# EAGLE design TinyAPRS-mini (EAGLE 7.2.0)
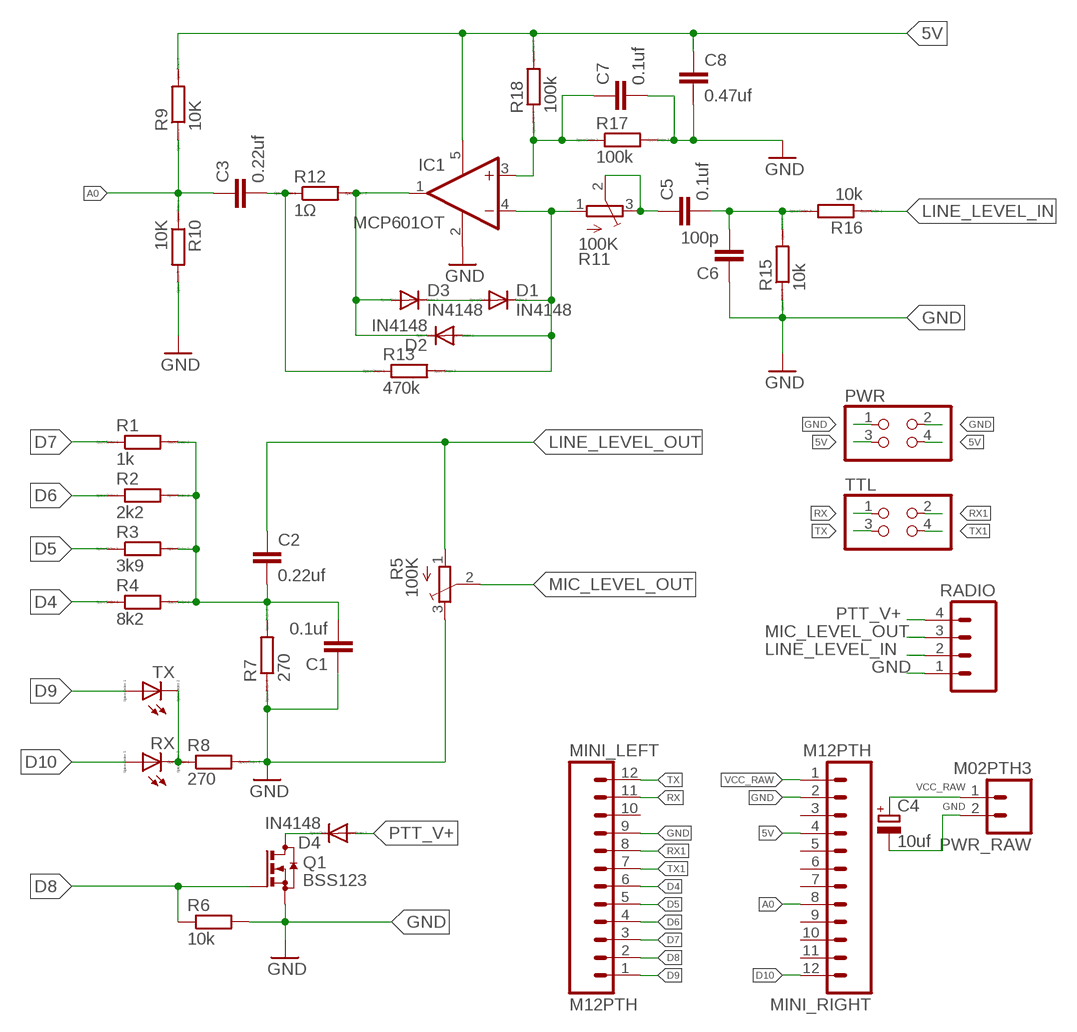
[diagram p0: schematic, sheet 1]

## Parts
C1  0.1uf  C-EU050-024X044  [C050-024X044]
C2  0.22uf  C-EU050-024X044  [C050-024X044]
C3  0.22uf  C-EU050-024X044  [C050-024X044]
C4  10uf  CPOL-EUE2.5-5  [E2,5-5]
C5  0.1uf  C-EU050-024X044  [C050-024X044]
C6  100p  C-EU050-024X044  [C050-024X044]
C7  0.1uf  C-EU050-024X044  [C050-024X044]
C8  0.47uf  C-EU050-024X044  [C050-024X044]
D1  IN4148  DIODE-D-2.5  [D-2.5]
D2  IN4148  DIODE-D-2.5  [D-2.5]
D3  IN4148  DIODE-D-2.5  [D-2.5]
D4  IN4148  DIODE-D-2.5  [D-2.5]
IC1  MCP601OT  [SOT23-5]
MINI_LEFT  M12PTH  [1X12]
MINI_RIGHT  M12PTH  [1X12]
PWR  PINHD-2X2  [2X02]
PWR_RAW  M02PTH3  [1X02_LONGPADS]
Q1  BSS123  [SOT23]
R1  1k  R-EU_0204_5  [0204/5]
R2  2k2  R-EU_0204_5  [0204/5]
R3  3k9  R-EU_0204_5  [0204/5]
R4  8k2  R-EU_0204_5  [0204/5]
R5  100K  TRIMPOTTC33X  [TC33X]
R6  10k  R-EU_0204/5  [0204/5]
R7  270  R-EU_0204_5  [0204/5]
R8  270  R-EU_0204_2V  [0204V]
R9  10K  R-EU_0204_5  [0204/5]
R10  10K  R-EU_0204_5  [0204/5]
R11  100K  TRIMPOTTC33X  [TC33X]
R12  1Ω  R-EU_0204_2V  [0204V]
R13  470k  R-EU_0204_5  [0204/5]
R15  10k  R-EU_0204_5  [0204/5]
R16  10k  R-EU_0204_5  [0204/5]
R17  100k  R-EU_0204_5  [0204/5]
R18  100k  R-EU_0204_5  [0204/5]
RADIO  M04PTH  [1X04]
RX  LED_ELD260  [LED_LD260]
TTL  PINHD-2X2  [2X02]
TX  LED_ELD260  [LED_LD260]

## Nets
5V: C8.1 IC1.5(V+) MINI_RIGHT.4 PWR.3 PWR.4 R9.2 R18.2
A0: C3.1 MINI_RIGHT.8 R9.1 R10.1
D4: MINI_LEFT.6 R4.1
D5: MINI_LEFT.5 R3.1
D6: MINI_LEFT.4 R2.1
D7: MINI_LEFT.3 R1.1
D8: MINI_LEFT.2 Q1.1(G) R6.1
D9: MINI_LEFT.1 TX.A
D10: MINI_RIGHT.12 RX.A
GND: C1.1 C4.- C6.1 C7.2 C8.2 IC1.2(V-) MINI_LEFT.9 MINI_RIGHT.2 PWR.1 PWR.2 PWR_RAW.2 Q1.2(S) R5.3(E) R6.2 R7.1 R8.2 R10.2 R15.1 R17.2 RADIO.1
LINE_LEVEL_IN: R16.1 RADIO.2
LINE_LEVEL_OUT: C2.1 R5.1(A)
MIC_LEVEL_OUT: R5.2(S) RADIO.3
N$1: R8.1 RX.K(C) TX.K(C)
N$2: D2.C D3.A IC1.1(OUT) R12.2
N$3: D1.C D2.A IC1.4(-IN) R11.1(A) R13.2
N$4: D4.C Q1.3(D)
N$6: C5.1 R11.2(S) R11.3(E)
N$7: C5.2 C6.2 R15.2 R16.2
N$8: C7.1 IC1.3(+IN) R17.1 R18.1
N$10: D1.A D3.C
N$11: C3.2 R12.1 R13.1
PTT_V+: D4.A RADIO.4
R_DAC: C1.2 C2.2 R1.2 R2.2 R3.2 R4.2 R7.2
RX: MINI_LEFT.11 TTL.1
RX1: MINI_LEFT.8 TTL.2
TX: MINI_LEFT.12 TTL.3
TX1: MINI_LEFT.7 TTL.4
VCC_RAW: C4.+ MINI_RIGHT.1 PWR_RAW.1
Unconnected: MINI_LEFT.10 MINI_RIGHT.3 MINI_RIGHT.5 MINI_RIGHT.6 MINI_RIGHT.7 MINI_RIGHT.9 MINI_RIGHT.10 MINI_RIGHT.11

## Library data of the parts
C1-C3 C5-C8 = rcl:C-EU: CAPACITOR, European symbol
C4 = rcl:CPOL-EU: POLARIZED CAPACITOR, European symbol
D1-D4 = diode:DIODE-: DIODE
IC1 = linear:MCP601: Single Op Amp 2.7V to 6.0V Single Supply CMOS Source: http://ww1.microchip.com/downloads/en/DeviceDoc/21314g.pdf
MINI_LEFT MINI_RIGHT = SparkFun-Connectors:M12: Header 12 Standard 12-pin 0.1" header. Use with straight break away headers (SKU : PRT-00116), right angle break away headers (PRT-00553), swiss pins (PRT-00743), machine pins (PRT-00117), and female headers (PRT-00115).
PWR TTL = pinhead:PINHD-2X2: PIN HEADER
PWR_RAW = SparkFun-Connectors:M02: Standard 2-pin 0.1" header. Use with - straight break away headers ( PRT-00116) - right angle break away headers (PRT-00553) - swiss pins (PRT-00743) - machine pins (PRT-00117) - female headers (PRT-00115) Molex polarized connector foot print use with: PRT-08233 with associated crimp pins and housings. 2.54_SCREWTERM for use with PRT-10571. 3.5mm Screw Terminal footprints for PRT-08084 5mm Screw Terminal footprints for use with PRT-08432
Q1 = transistor-small-signal:BSS123: N-CHANNEL MOS FET
R1-R4 R7-R10 R12 R13 R15-R18 = resistor:R-EU_: RESISTOR, European symbol; SPICEPREFIX: R
R5 R11 = adafruit:TRIMPOT: SMT trimmer potentiometer part number TC33X http://www.ladyada.net/library/eagle
R6 = rcl:R-EU_: RESISTOR, European symbol
RADIO = SparkFun-Connectors:M04: Header 4 Standard 4-pin 0.1" header. Use with straight break away headers (SKU : PRT-00116), right angle break away headers (PRT-00553), swiss pins (PRT-00743), machine pins (PRT-00117), and female headers (PRT-00115). Molex polarized connector foot print use with SKU : PRT-08231 with associated crimp pins and housings. 1MM SMD Version SKU: PRT-10208
RX TX = eagle-ltspice:LED_E: LED Source: http://www.osram.convergy.de Source: www.luxeon.com Source: www.kingbright.com; SPICEMODEL: NONE; SPICEPREFIX: D; SPICETYPE: diode

## Board
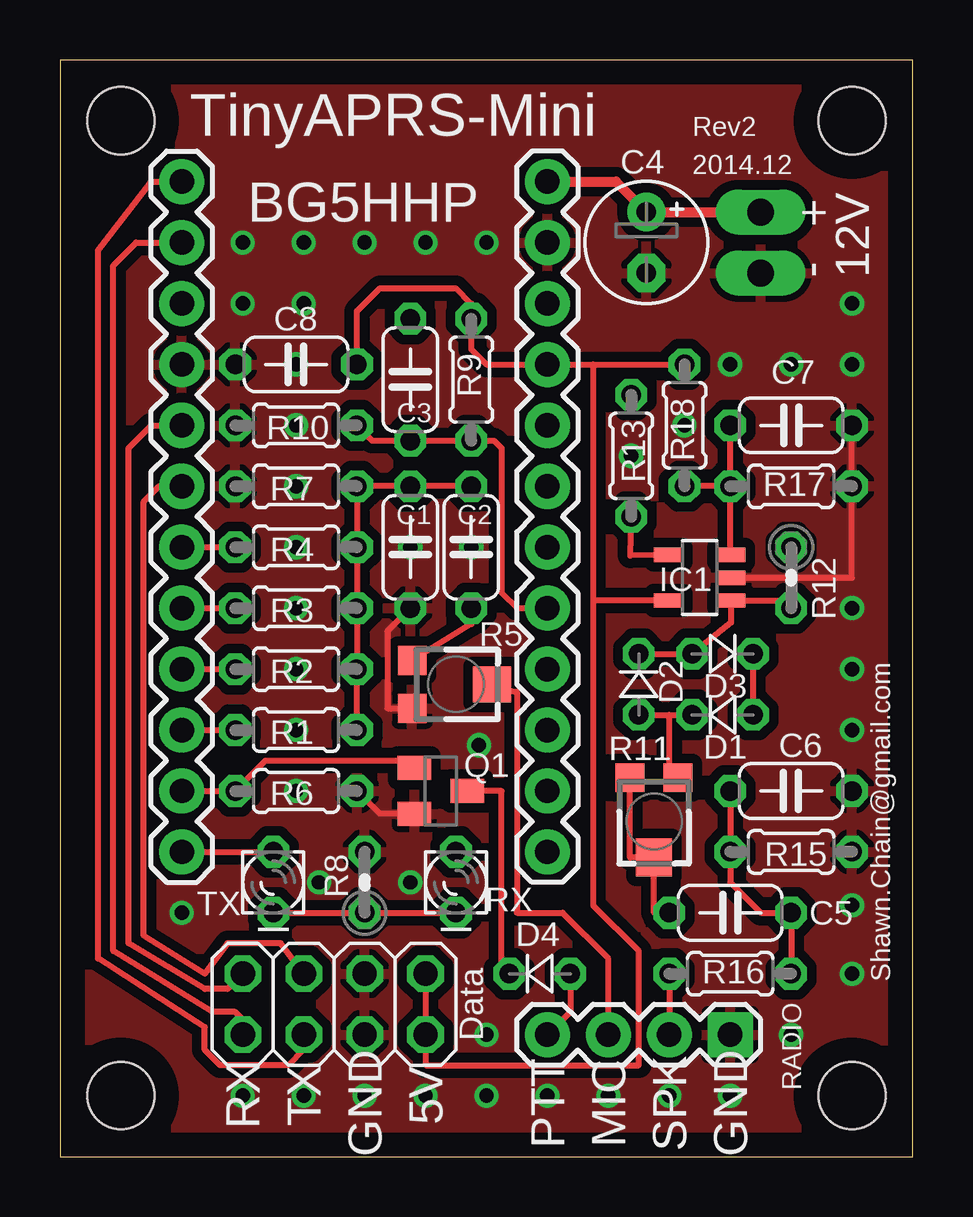
[diagram p1: board, top side]
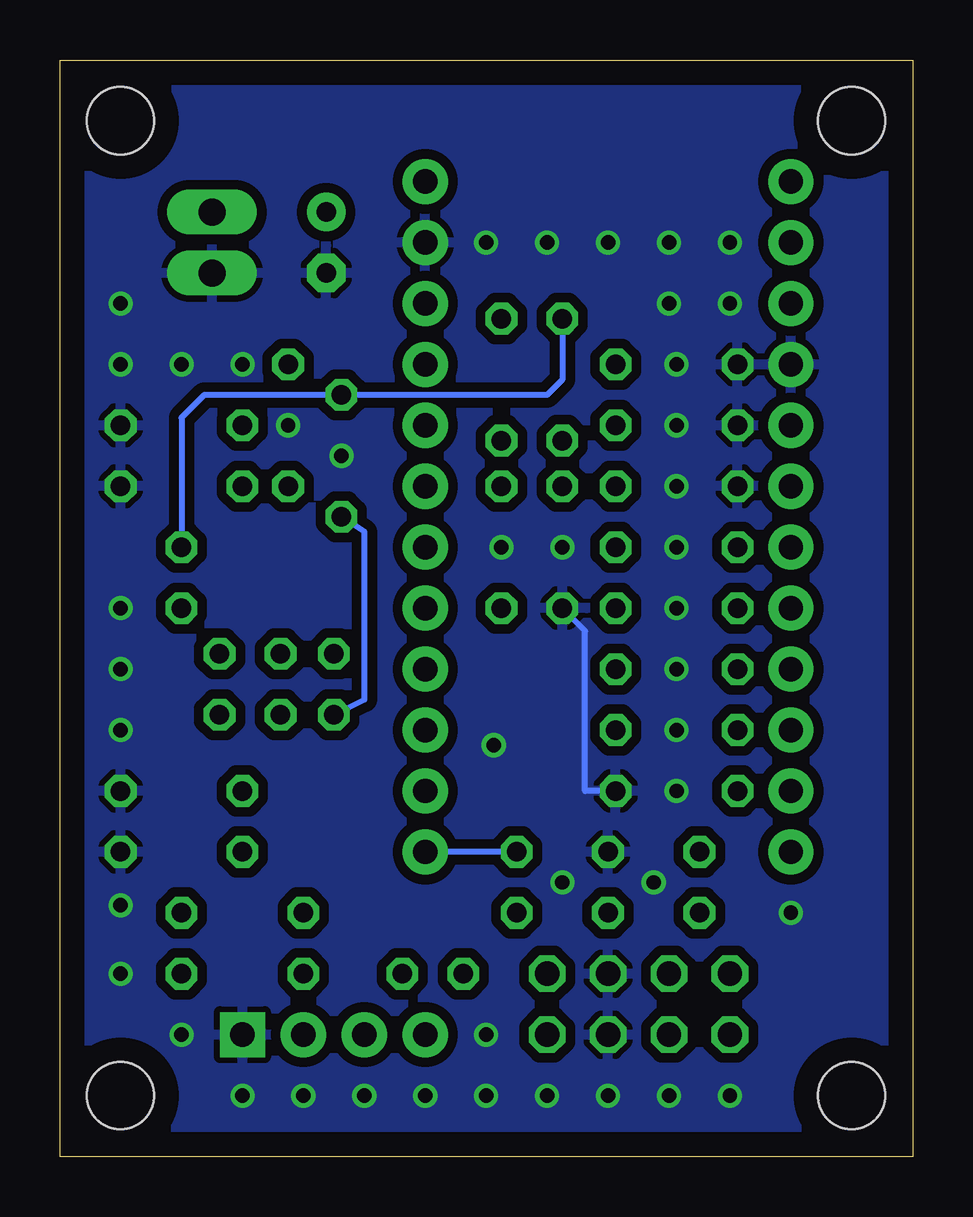
[diagram p2: board, bottom side, seen from below]

Size 35.55 x 45.71 mm. Coordinates in mm from the lower left corner, seen from the top.
Outline: 0,45.71 0,0 35.55,0 35.55,45.71 0,45.71
Copper layers (1*16): Top 0.035mm / dielectric 1.5mm / Bottom 0.035mm
Design rules "default *": minimum track width 10mil, minimum drill 0.6mm, track to track 8mil, track to pad 8mil, pad to pad 8mil, via to via 8mil, smd to smd 8mil, copper to edge 40mil, drill to drill 8mil, minimum pad ring 10mil, minimum via ring 8mil, stop-mask expansion 4mil, vias tented up to drill 0.7mm, thermal gap 10mil
Holes 2.8 mm at 33.02,43.18 33.02,2.54 2.54,2.54 2.54,43.18

### Footprints (pad centres in the part's own frame; a part is rotated, then mirrored left to right if it is on the bottom)
C050-024X044 = drill 0.813 octagon: 1 -2.54,0; 2 2.54,0
E2,5-5 = drill 0.813 pad 1.6: + -1.27,0 | drill 0.813 pad 1.6 octagon: - 1.27,0
D-2.5 = drill 0.813 octagon: A 1.27,0; C -1.27,0
SOT23-5 = smd 0.6 x 1.2: 1 -0.95,-1.306; 2 0,-1.306; 3 0.95,-1.306; 4 0.95,1.306; 5 -0.95,1.306
1X12 = drill 1.016 pad 1.88: 1 0,0; 2 2.54,0; 3 5.08,0; 4 7.62,0; 5 10.16,0; 6 12.7,0; 7 15.24,0; 8 17.78,0; 9 20.32,0; 10 22.86,0; 11 25.4,0; 12 27.94,0
2X02 = drill 1.016 octagon: 1 -1.27,-1.27; 2 -1.27,1.27; 3 1.27,-1.27; 4 1.27,1.27
1X02_LONGPADS = drill 1.118 pad 1.88 long: 1 0,0; 2 2.54,0
SOT23 = smd 1 x 1.4: 1 -0.95,-1.1; 2 0.95,-1.1; 3 0,1.1
0204/5 = drill 0.813 octagon: 1 -2.54,0; 2 2.54,0
TC33X = smd 1.2 x 1.2: 1 -1,-1.825; 3 1,-1.825 | smd 1.5 x 1.6: 2 0,1.5
0204V = drill 0.813 octagon: 1 -1.27,0; 2 1.27,0
1X04 = drill 1.016 pad 1.88 square: 1 0,0 | drill 1.016 pad 1.88: 2 2.54,0; 3 5.08,0; 4 7.62,0
LED_LD260 = drill 0.813 octagon: A -1.27,0; K 1.27,0

### Placement (x,y rotation side)
C1  14.61,25.4 90 top
C2  17.14,25.4 90 top
C3  14.61,32.38 90 top
C4  24.45,38.1 270 top
C5  27.94,10.16 0 top
C6  30.48,15.24 180 top
C7  30.48,30.48 0 top
C8  9.84,33.02 180 top
D1  27.62,18.41 0 top
D2  24.13,19.68 270 top
D3  27.62,20.95 180 top
D4  20,7.62 0 top
IC1  26.67,24.13 90 top
MINI_LEFT  5.08,12.7 90 top
MINI_RIGHT  20.32,40.64 270 top
PWR  13.97,6.35 0 top
PWR_RAW  29.21,39.37 270 top
Q1  15.88,15.24 270 top
R1  9.84,17.78 0 top
R2  9.84,20.32 0 top
R3  9.84,22.86 0 top
R4  9.84,25.4 0 top
R5  16.51,19.68 270 top
R6  9.84,15.24 0 top
R7  9.84,27.94 0 top
R8  12.7,11.43 90 top
R9  17.14,32.38 90 top
R10  9.84,30.48 180 top
R11  24.77,13.97 180 top
R12  30.48,24.13 270 top
R13  23.81,29.21 270 top
R15  30.48,12.7 180 top
R16  27.94,7.62 0 top
R17  30.48,27.94 0 top
R18  26.04,30.48 90 top
RADIO  27.94,5.08 180 top
RX  16.51,11.43 270 top
TTL  8.89,6.35 0 top
TX  8.89,11.43 270 top

### Tracks (layer width: path | path; a pad name or v marks a point on that pad's centre or on a via)
5V
  Top 0.254: 22.23,33.02 MINI_RIGHT.4 17.78,33.02 17.14,33.66 R9.2 17.14,35.56 16.51,36.2 13.34,36.2 12.38,35.24 C8.1 | 22.23,33.02 22.23,23.18 | 22.23,23.18 22.23,10.48 24.13,8.57 24.13,3.81 15.24,3.81 PWR.3 PWR.4 | IC1.5 22.23,23.18 | 22.23,33.02 R18.2
A0
  Top 0.254: R10.1 13.02,29.84 C3.1 R9.1 18.1,29.84 18.41,29.53 18.41,23.5 19.05,22.86 MINI_RIGHT.8
D4
  Top 0.254: MINI_LEFT.6 R4.1
D5
  Top 0.254: MINI_LEFT.5 R3.1
D6
  Top 0.254: MINI_LEFT.4 R2.1
D7
  Top 0.254: MINI_LEFT.3 R1.1
D8
  Top 0.254: Q1.1 15.24,16.19 14.92,16.51 8.57,16.51 R6.1 MINI_LEFT.2
D9
  Top 0.254: MINI_LEFT.1 TX.A
D10
  Bottom 0.254: RX.A MINI_RIGHT.12
GND  (via drill 0.6)
  Top 0.254: Q1.2 13.34,14.29 R6.2 | C1.1 13.65,21.91 13.65,18.68 R5.3 | IC1.2 33.02,24.13 R17.2 C7.2
  Bottom 0.254: R6.2 13.65,15.24 13.65,21.91 C1.1
  other vias: 7.62,38.1 10.16,38.1 12.7,38.1 15.24,38.1 9.84,33.02 9.84,30.48 9.84,27.94 9.84,25.4 9.84,22.86 9.84,20.32 9.84,17.78 9.84,15.24 17.14,25.4 14.61,25.4 17.78,38.1 23.81,29.21 26.04,30.48 33.02,33.02 33.02,35.56 33.02,22.86 33.02,20.32 33.02,17.78 33.02,10.48 33.02,7.62 27.94,2.54 25.4,2.54 22.86,2.54 20.32,2.54 17.78,2.54 15.24,2.54 12.7,2.54 10.16,2.54 7.62,2.54 5.08,10.16 17.78,5.08 30.48,5.08 10.79,11.43 14.61,11.43 17.46,17.14 10.16,35.56 7.62,35.56 30.48,33.02 27.94,33.02
  pour Bottom (isolate 0.406): 0,45.72 0,0 35.56,0 35.56,45.72
  pour Top (isolate 0.406): 0,45.72 0,0 35.56,0 35.56,45.72
LINE_LEVEL_IN
  Top 0.254: R16.1 RADIO.2
LINE_LEVEL_OUT
  Top 0.254: C2.1 17.14,22.19 R5.1
MIC_LEVEL_OUT
  Top 0.254: R5.2 18.64,19.45 19.05,19.37 19.05,10.16 20.95,10.16 22.86,8.26 RADIO.3
N$1
  Top 0.254: TX.K R8.1 RX.K
N$2
  Top 0.254: R12.2 30.16,23.18 IC1.1 27.98,22.26 D3.A D2.C
N$3
  Top 0.254: IC1.4 23.78,25.05 R13.2 | R11.1 25.4,15.79 25.4,18.41 | D2.A 25.4,18.41 | 25.4,18.41 D1.C
  Bottom 0.254: D2.A 22.86,19.05 22.86,26.04 R13.2
N$4
  Top 0.254: D4.C 18.41,7.94 18.41,15.24 Q1.3
N$6
  Top 0.254: C5.1 24.77,10.16 R11.2 23.77,12.47 R11.3
N$7
  Top 0.254: C6.2 R15.2 27.94,11.43 29.21,10.16 C5.2 R16.2
N$8
  Top 0.254: IC1.3 27.94,25.08 R17.1 | R17.1 C7.1 | R17.1 R18.1
N$10
  Top 0.254: D3.C D1.A
N$11
  Bottom 0.254: R12.1 30.48,30.8 29.53,31.75 R13.1 15.24,31.75 14.61,32.38 C3.2
PTT_V+
  Top 0.254: D4.A 21.27,6.03 RADIO.4
R_DAC
  Top 0.254: C2.2 C1.2 R7.2 R4.2 R3.2 R2.2 R1.2
RX
  Top 0.254: TTL.1 7.62,5.71 7.3,6.03 6.35,6.03 2.22,8.57 2.22,37.15 3.17,38.1 MINI_LEFT.11
RX1
  Top 0.254: TTL.2 6.99,6.99 6.03,6.99 2.86,8.89 2.86,29.53 3.81,30.48 MINI_LEFT.8
TX
  Top 0.254: TTL.3 10.16,4.45 9.53,3.81 6.67,3.81 6.03,4.45 6.03,5.4 1.59,8.26 1.59,37.78 3.81,40.64 MINI_LEFT.12
TX1
  Top 0.254: TTL.4 9.21,8.89 6.99,8.89 6.03,7.62 3.49,9.21 3.49,27.3 4.13,27.94 MINI_LEFT.7
VCC_RAW
  Top 0.406: MINI_RIGHT.1 23.18,40.64 C4.+ PWR_RAW.1

### Text on the board
tPlace: TinyAPRS-Mini | Rev2 | BG5HHP | 2014.12 | Shawn.Chain@gmail.com
tSilk: + | 12V | - | Data | RX | TX | 5V | GND | PTT | MIC | SPK | GND